# Altium schematic sheet +5Vdc.SchDoc
size A3
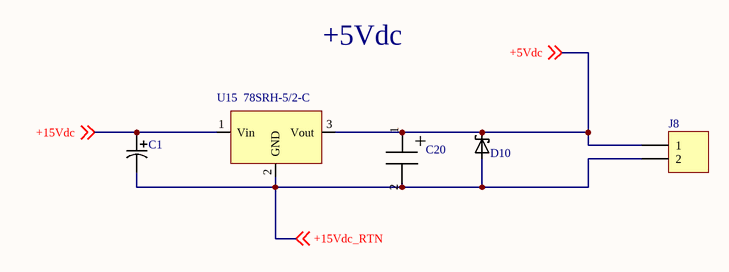
[diagram p0: +5Vdc.SchDoc]

## Parts
C1  UBC1H470MNS1GS  [UBC1H470MNS1GS]  (value not drawn)
C20  10SVPC120M  [PANASONIC SVPC SERIES]  (value not drawn)
D10  SMCJ5.0A  [TVS Diode DO-214AB-2 (SMC)]  (value not drawn)
J8  Header 2  [HDR1X2]  (value not drawn)
U15  78SRH-5/2-C  [78SR-5/2-C]

## Nets
+5Vdc: C20.1 D10.C J8.1 U15.3(Vout) ; off-sheet +5Vdc
+15Vdc: C1.1 U15.1(Vin) ; off-sheet +15Vdc
+15Vdc_RTN: C1.2 C20.2 D10.A J8.2 U15.2(GND) ; off-sheet +15Vdc_RTN

## Notes on the sheet
- +5Vdc
- (in symbol Panasonic electrolitic cap SVPC) +

## Library data of the parts
C1 = Nichicon electrolitic capacitor: MD 50volts 47uF; ComponentLink1Description: UBC1H470MNS1GS; ComponentLink1URL: https://www.mouser.es/ProductDetail/Nichicon/UBC1H470MNS1GS?qs=U1PqRs5SEBtOy06pTkWJCw%3D%3D&vip=1&gclid=CjwKCAjwqpP2BRBTEiwAfpiD-zT2IHj2dmGJDoxoCUlwFGgo7ytp52iPk_zVmh_n4eTfZDHl6q4jrxoCD5AQAvD_BwE
C20 = Panasonic electrolitic cap SVPC: 10volts 120uF ESR 27mohm; ComponentLink1Description: 10SVPC120M; ComponentLink1URL: https://www.mouser.es/ProductDetail/Panasonic/10SVPC120M?qs=sGAEpiMZZMsIwzbKW1rlgZRRlI97jKasVTg%2Fx1x3B4w%3D
D10 = TVS SMCJxxA: SMC do-214AB-2; ComponentLink1Description: SMCJ5.0A; ComponentLink1URL: https://www.mouser.es/ProductDetail/Bourns/SMCJ50A?qs=%252Bf8Cd6aE5bxP5YHLnOwndA%3D%3D
J8 = Header 2: Header, 2-Pin; LatestRevisionDate: 17-Jul-2002; LatestRevisionNote: Re-released for DXP Platform.; Publisher: Altium Limited
U15 = 78SR-5/2-C: Convertidores CC/CC no aislados 8-32Vin 5Vout 2A SIP Switching Reg.; ComponentLink1Description: 78SRH-5/2-C; ComponentLink1URL: https://www.mouser.es/ProductDetail/Murata-Power-Solutions/78SRH-5-2-C?qs=%2Fha2pyFaduhqPOpHwIdzX%252BmJBXU5MwVRtt0xC2MUQi8aOSO3n%252BGaGw%3D%3D; ComponentLink2Description: Datasheet; ComponentLink2URL: https://www.mouser.es/datasheet/2/281/mpm_78sr-2a_a00-42390.pdf